# EAGLE design TRV_MRF49_U_V1.1_F (EAGLE 6.3)
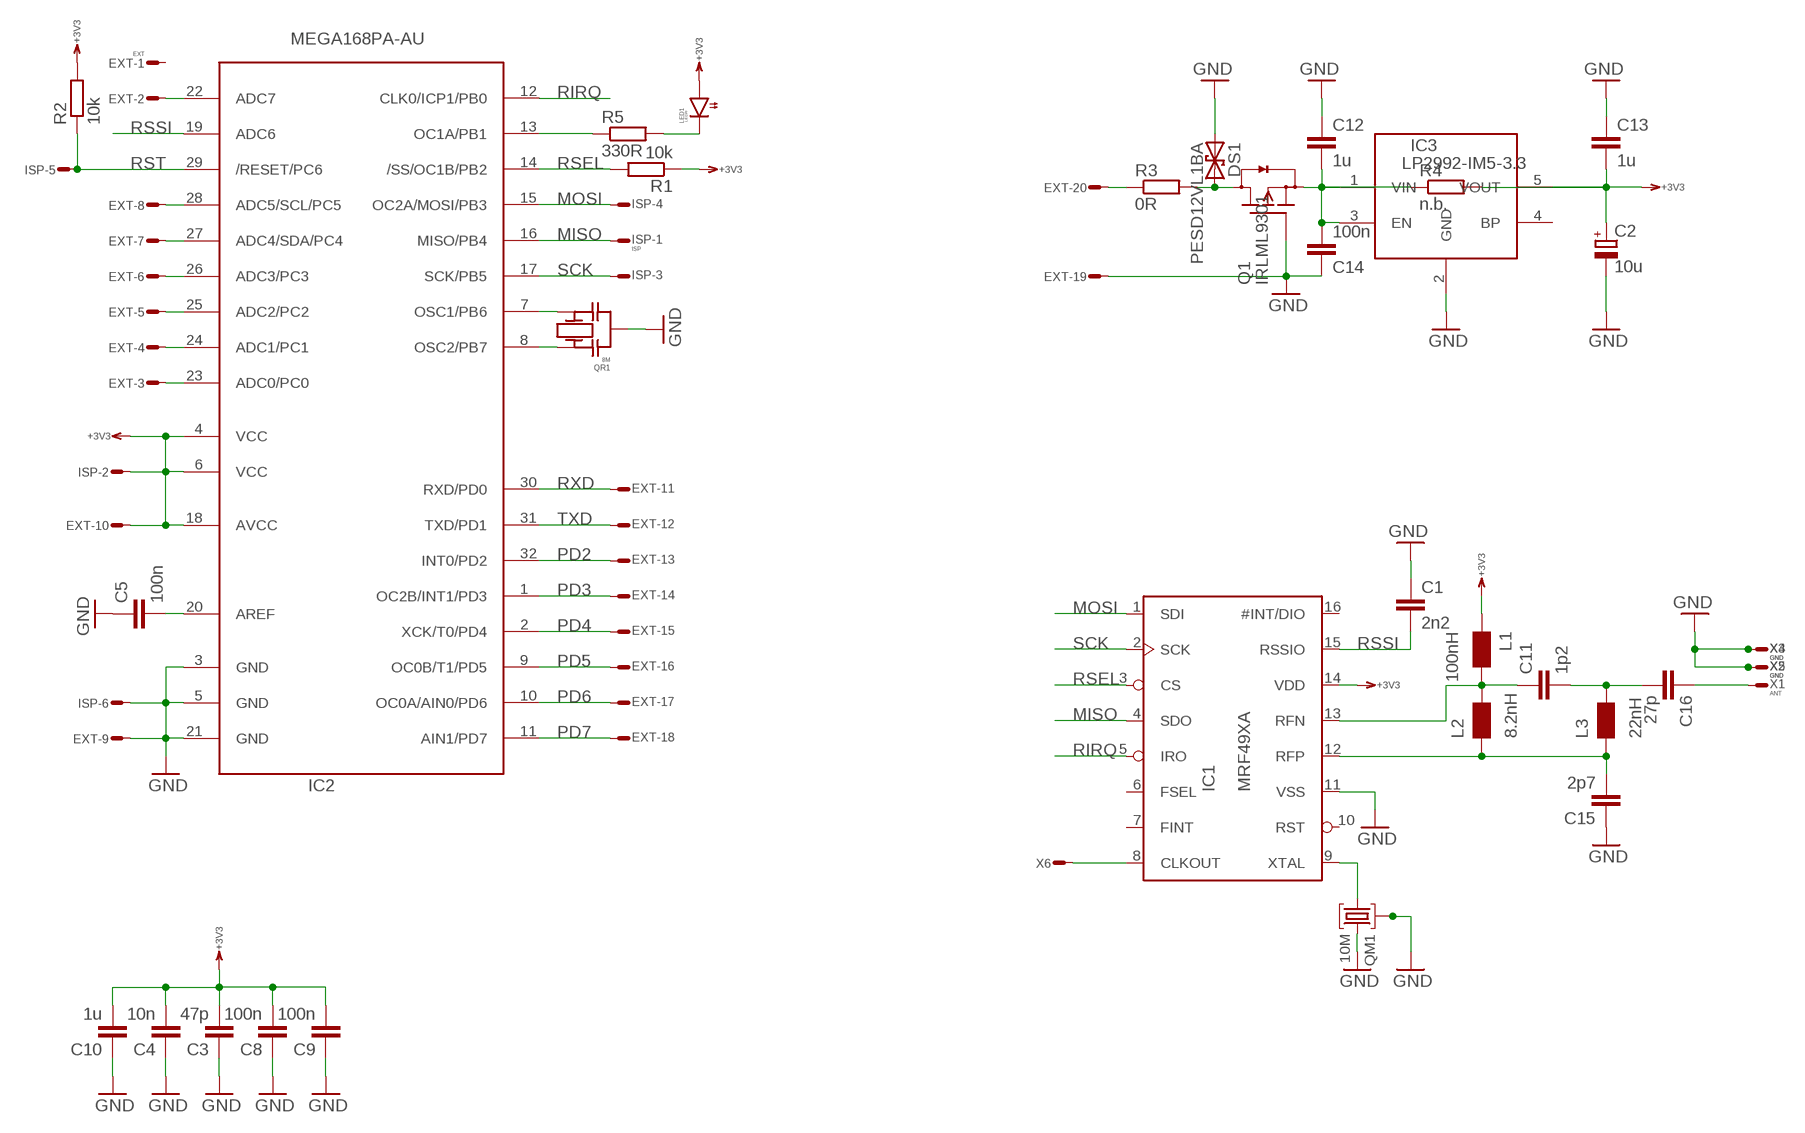
[diagram p0: schematic, sheet 1]

## Parts
C1  2n2  C0603  [0603]
C2  10u  C_POLSMCB  [SMC_B]
C3  47p  C0603  [0603]
C4  10n  C0603  [0603]
C5  100n  C0603  [0603]
C8  100n  C0603  [0603]
C9  100n  C0603  [0603]
C10  1u  C0603  [0603]
C11  1p2  C0603  [0603]
C12  1u  C0603  [0603]
C13  1u  C0603  [0603]
C14  100n  C0603  [0603]
C15  2p7  C0603  [0603]
C16  27p  C0603  [0603]
DS1  PESD12VL1BA  TVS-U323  [SOD323]
EXT  EXT  ML20SE  [ML20S]
IC1  MRF49XA  [TSSOP16]
IC2  MEGA168PA-AU  MEGA168PA  [TQFP32-08]
IC3  LP2992-IM5-3.3  LDO  [SOT23-5]
ISP  ISP  ML6ES  [ML6S]
L1  100nH  L0603  [0603]
L2  8.2nH  L0603  [0603]
L3  22nH  L0603  [0603]
LED1  LEDR  LED0603  [0603]
Q1  IRLML9301  FET-PDSOT23  [SOT23]
QM1  10M  QM5X3.2  [ABM3C]
QR1  8M  QRCR  [CR]
R1  10k  R0603  [0603]
R2  10k  R0603  [0603]
R3  0R  R0603  [0603]
R4  n.b.  R0603  [0603]
R5  330R  R0603  [0603]
X1  ANT  WIREPADS2.54/1.27  [S2.54/1.27]
X2  GND  WIREPADS2.54/1.27  [S2.54/1.27]
X3  GND  WIREPADS2.54/1.27  [S2.54/1.27]
X4  GND  WIREPADS2.54/1.27  [S2.54/1.27]
X5  GND  WIREPADS2.54/1.27  [S2.54/1.27]
X6  WIREPADR  [S1.27R]

## Nets
+3V3: C2.+ C3.2 C4.2 C8.2 C9.2 C10.2 C13.2 EXT.10 IC1.14(VDD) IC2.4(VCC) IC2.6(VCC) IC2.18(AVCC) IC3.5(VOUT) ISP.2 L1.1 LED1.1(A) R1.1 R2.2 R4.2
GND: C1.1 C2.- C3.1 C4.1 C5.1 C8.1 C9.1 C10.1 C12.1 C13.1 C14.1 C15.1 DS1.A EXT.9 EXT.19 IC1.11(VSS) IC2.3(GND) IC2.5(GND) IC2.21(GND) IC3.2(GND) ISP.6 Q1.1(G) QM1.P$2(M1) QM1.P$3 QM1.P$4(M2) QR1.M X2.1(S) X3.1(S) X4.1(S) X5.1(S)
MISO: IC1.4(SDO) IC2.16(MISO/PB4) ISP.1
MOSI: IC1.1(SDI) IC2.15(OC2A/MOSI/PB3) ISP.4
N$1: IC1.8(CLKOUT) X6.1(S)
N$2: C11.2 C16.2 L3.2
N$3: EXT.2 IC2.22(ADC7)
N$4: IC1.9(XTAL) QM1.P$1
N$5: DS1.C Q1.3(D) R3.2
N$6: C5.2 IC2.20(AREF)
N$7: IC2.8(OSC2/PB7) QR1.1
N$8: IC2.7(OSC1/PB6) QR1.2
N$9: EXT.20 R3.1
N$10: IC2.13(OC1A/PB1) R5.1
N$12: C12.2 C14.2 IC3.1(VIN) IC3.3(EN) Q1.2(S) R4.1
N$15: C11.1 IC1.13(RFN) L1.2 L2.2
N$21: LED1.2(C) R5.2
N$24: C15.2 IC1.12(RFP) L2.1 L3.1
N$25: C16.1 X1.1(S)
PC0: EXT.3 IC2.23(ADC0/PC0)
PC1: EXT.4 IC2.24(ADC1/PC1)
PC2: EXT.5 IC2.25(ADC2/PC2)
PC3: EXT.6 IC2.26(ADC3/PC3)
PC4: EXT.7 IC2.27(ADC4/SDA/PC4)
PC5: EXT.8 IC2.28(ADC5/SCL/PC5)
PD2: EXT.13 IC2.32(INT0/PD2)
PD3: EXT.14 IC2.1(OC2B/INT1/PD3)
PD4: EXT.15 IC2.2(XCK/T0/PD4)
PD5: EXT.16 IC2.9(OC0B/T1/PD5)
PD6: EXT.17 IC2.10(OC0A/AIN0/PD6)
PD7: EXT.18 IC2.11(AIN1/PD7)
RIRQ: IC1.5(IRO) IC2.12(CLK0/ICP1/PB0)
RSEL: IC1.3(CS) IC2.14(/SS/OC1B/PB2) R1.2
RSSI: C1.2 IC1.15(RSSIO) IC2.19(ADC6)
RST: IC2.29(/RESET/PC6) ISP.5 R2.1
RXD: EXT.11 IC2.30(RXD/PD0)
SCK: IC1.2(SCK) IC2.17(SCK/PB5) ISP.3
TXD: EXT.12 IC2.31(TXD/PD1)
Unconnected: EXT.1 IC1.6(FSEL) IC1.7(FINT) IC1.10(RST) IC1.16(#INT/DIO) IC3.4(BP)

## Library data of the parts
C1 C3-C5 C8-C16 = RCL:C: Capacitor SMD
C2 = RCL:C_POL: POLARIZED CAPACITOR, European symbol
DS1 = Diode:TVS-U: DIODE
EXT = Conn:ML20?E: HARTING
IC1 = Other:MRF49XA
IC2 = atmel:MEGA168P: MCU, 4/8/16k, TQFP32
IC3 = DCDC:LDO
ISP = Conn:ML6E: HARTING
L1-L3 = RCL:L
LED1 = Optic:LED
Q1 = Transistor:FET-PD
QM1 = QUARTZ:QM
QR1 = QUARTZ:QR
R1-R5 = RCL:R: Resistor SMD
X1-X6 = Conn:WIREPAD: Wire PAD connect wire on PCB

## Board
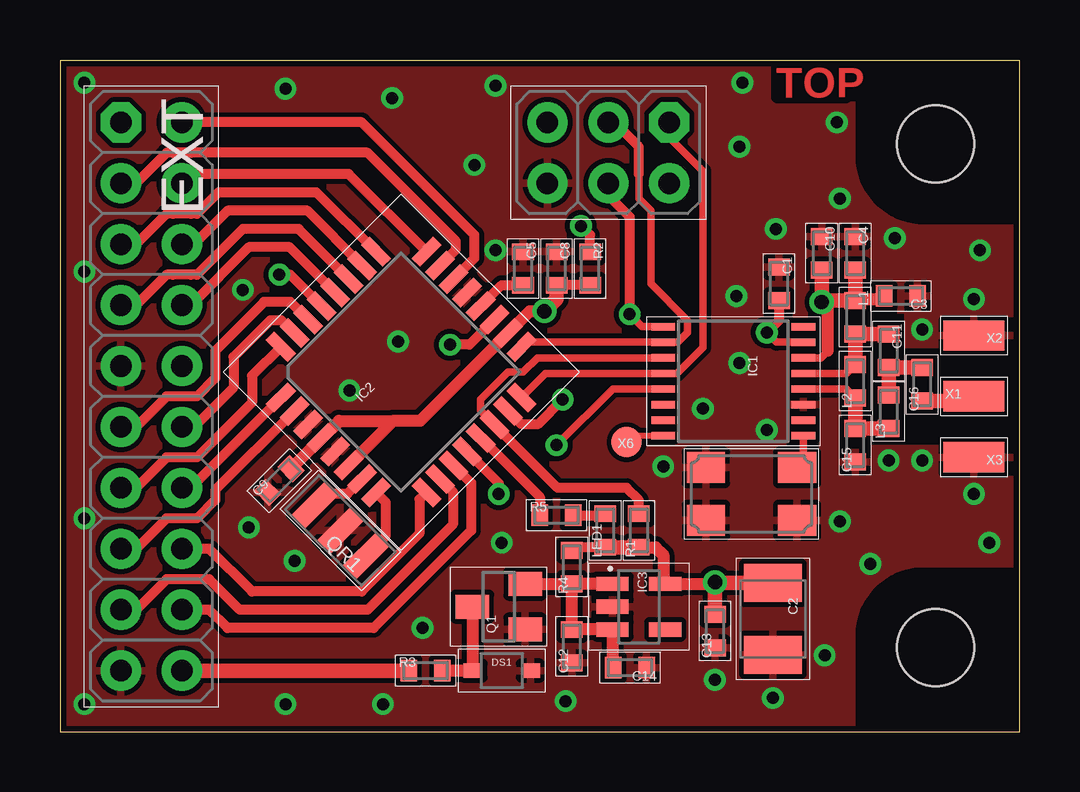
[diagram p1: board, top side]
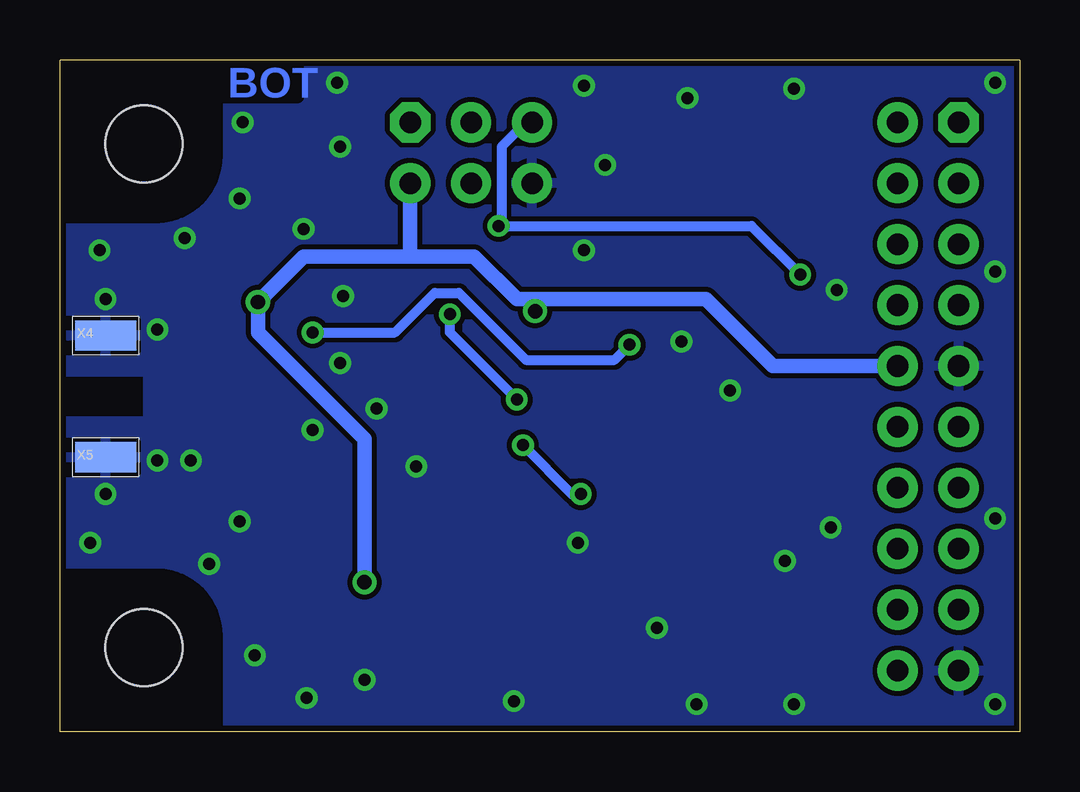
[diagram p2: board, bottom side, seen from below]

Size 40 x 28 mm. Coordinates in mm from the lower left corner, seen from the top.
Outline: 0,0 40,0 40,28 0,28 0,0
Copper layers (1*16): Top 0.035mm / dielectric 1.5mm / Bottom 0.035mm
Design rules "default *": minimum track width 8mil, minimum drill 0.3mm, track to track 8mil, track to pad 8mil, pad to pad 8mil, via to via 8mil, smd to smd 8mil, copper to edge 10mil, drill to drill 8mil, minimum pad ring 5mil, minimum via ring 8mil, stop-mask expansion 4mil, vias tented up to drill 25mil, thermal gap 8mil
Holes 3.2 mm at 36.5,24.5 36.5,3.5
tRestrict: area 32.5,17.1 to 35.2,17.4; area 32.5,11.8 to 33.8,12.1

### Footprints (pad centres in the part's own frame; a part is rotated, then mirrored left to right if it is on the bottom)
0603 = smd 0.7 x 0.9: 1 -0.697,0; 2 0.697,0
SMC_B = smd 1.6 x 2.4: + -1.5,0; - 1.5,0
SOD323 = smd 0.8 x 0.6: A 1.2,0; C -1.2,0
ML20S = drill 0.9 pad 1.676 octagon: 1 -11.43,-1.27 | drill 0.9 pad 1.676: 2 -11.43,1.27; 3 -8.89,-1.27; 4 -8.89,1.27; 5 -6.35,-1.27; 6 -6.35,1.27; 7 -3.81,-1.27; 8 -3.81,1.27; 9 -1.27,-1.27; 10 -1.27,1.27; 11 1.27,-1.27; 12 1.27,1.27; 13 3.81,-1.27; 14 3.81,1.27; 15 6.35,-1.27; 16 6.35,1.27; 17 8.89,-1.27; 18 8.89,1.27; 19 11.43,-1.27; 20 11.43,1.27
TSSOP16 = smd 0.305 x 0.991: 1 -2.275,-2.918; 2 -1.625,-2.918; 3 -0.975,-2.918; 4 -0.325,-2.918; 5 0.325,-2.918; 6 0.975,-2.918; 7 1.625,-2.918; 8 2.275,-2.918; 9 2.275,2.918; 10 1.625,2.918; 11 0.975,2.918; 12 0.325,2.918; 13 -0.325,2.918; 14 -0.975,2.918; 15 -1.625,2.918; 16 -2.275,2.918
TQFP32-08 = smd 1.27 x 0.5: 1 -4.293,2.8; 2 -4.293,2; 3 -4.293,1.2; 4 -4.293,0.4; 5 -4.293,-0.4; 6 -4.293,-1.2; 7 -4.293,-2; 8 -4.293,-2.8; 17 4.293,-2.8; 18 4.293,-2; 19 4.293,-1.2; 20 4.293,-0.4; 21 4.293,0.4; 22 4.293,1.2; 23 4.293,2; 24 4.293,2.8 | smd 0.5 x 1.27: 9 -2.8,-4.293; 10 -2,-4.293; 11 -1.2,-4.293; 12 -0.4,-4.293; 13 0.4,-4.293; 14 1.2,-4.293; 15 2,-4.293; 16 2.8,-4.293; 25 2.8,4.293; 26 2,4.293; 27 1.2,4.293; 28 0.4,4.293; 29 -0.4,4.293; 30 -1.2,4.293; 31 -2,4.293; 32 -2.8,4.293
SOT23-5 = smd 0.6 x 1.35: 1 -0.95,-1.101; 2 0,-1.101; 3 0.95,-1.101; 4 0.95,1.101; 5 -0.951,1.101
ML6S = drill 0.9 pad 1.676 octagon: 1 -2.54,-1.27 | drill 0.9 pad 1.676: 2 -2.54,1.27; 3 0,-1.27; 4 0,1.27; 5 2.54,-1.27; 6 2.54,1.27
SOT23 = smd 1 x 1.4: 1 -0.95,-1.1; 2 0.95,-1.1; 3 0,1.1
ABM3C = smd 1.6 x 1.3: P$1 -1.9,-1.1; P$2 1.9,-1.1; P$3 1.9,1.1; P$4 -1.9,1.1
CR = smd 0.8 x 2: 1 -1.5,0; 2 1.5,0; M 0,0
S2.54/1.27 = smd 1.27 x 2.54: 1 0,0
S1.27R = smd 1.27 x 1.27: 1 0,0

### Placement (x,y rotation side)
C1  29.97,18.67 270 top
C2  29.72,4.7 270 top
C3  35.05,18.16 180 top
C4  33.15,19.94 270 top
C5  19.3,19.3 270 top
C8  20.7,19.3 270 top
C9  9.14,10.46 45 top
C10  31.75,19.94 270 top
C11  34.54,15.88 270 top
C12  21.34,3.56 90 top
C13  27.3,4.19 90 top
C14  23.76,2.67 180 top
C15  33.15,11.94 90 top
C16  35.94,14.48 90 top
DS1  18.41,2.54 0 top
EXT  3.81,13.97 270 top
IC1  28.07,14.61 270 top
IC2  14.22,14.99 45 top
IC3  24.13,5.21 270 top
ISP  22.86,24.13 180 top
L1  33.15,17.27 270 top
L2  33.15,14.61 90 top
L3  34.54,13.34 90 top
LED1  22.73,8.38 90 top
Q1  18.29,5.21 90 top
QM1  28.83,9.91 180 top
QR1  11.68,8.38 135 top
R1  24.13,8.38 90 top
R2  22.1,19.3 270 top
R3  15.24,2.54 0 top
R4  21.34,6.86 90 top
R5  20.7,9.02 0 top
X1  38.1,13.97 270 top
X2  38.1,16.51 90 top
X3  38.1,11.43 90 top
X4  38.1,16.51 270 bottom
X5  38.1,11.43 270 bottom
X6  23.62,12.06 0 top

### Tracks (layer width: path | path; a pad name or v marks a point on that pad's centre or on a via)
+3V3  (via drill 0.6)
  Top 0.305: IC1.14 31.71,15.58 32,15.88
  Top 0.406: C9.2 | 32,17.65 v31.75,17.91 | LED1.1 21.46,7.68 R4.2 | R2.2 C8.2
  Top 0.508: C9.2 IC2.4 11.63,12.95 13.89,12.95 | 32,15.88 32,17.65 | 33.15,18.03 34.35,18.03 C3.2 | R1.1 24.83,7.68 25.15,7.37 25.15,6.24 IC3.5 27.24,6.16 v27.3,6.22 | v20.19,17.53 19.59,17.53 IC2.18 15.02,12.95 13.89,12.95 | IC2.6 13.89,12.95
  Top 0.61: LED1.1 R1.1 | C10.2 v31.75,17.91 31.81,17.97 L1.1 33.15,18.03 C4.2 | C13.2 v27.3,6.22 27.33,6.2 C2.+ | C8.2 20.7,18.03 v20.19,17.53
  Bottom 0.61: v27.3,6.22 27.3,12.19 31.75,16.64 v31.75,17.91 29.84,19.81 25.4,19.81 | EXT.10 10.29,15.24 13.08,18.03 20.19,18.03 | ISP.2 25.4,19.81 | 20.19,18.03 20.95,18.03 22.73,19.81 25.4,19.81 | v20.19,17.53 20.19,18.03
GND  (via drill 0.5)
  other vias: 38.1,18.03 38.1,9.91 34.54,11.3 35.94,11.3 35.94,16.76 34.8,20.57 29.84,20.95 25.15,11.05 21.08,1.27 17.27,23.62 29.72,1.4 38.73,7.87 33.78,6.99 38.35,20.07 32.51,22.23 28.45,27.05 27.3,2.16 15.11,4.32 9.78,7.11 13.84,26.42 13.46,1.14 32.51,8.76 31.88,3.17 9.4,26.8 9.4,1.14 28.32,24.38 18.41,7.87 26.8,13.46 28.32,15.37 12.06,14.22 14.1,16.26 7.87,8.51 29.46,12.57 28.19,18.16 7.62,18.41 18.16,20.07 32.38,25.4 18.16,26.92 1.02,27.05 1.02,1.14 1.02,19.18 1.02,8.89
  pour Top: 0,0 33,0 33,4 arc-90 36,7 40,7 40,11.81 32.64,11.81 32.64,16.13 40,16.13 40,21 36,21 arc-90 33,24 33,28 0,28
  pour Bottom: 0,0 33,0 33,4 arc-90 36,7 40,7 40,12.95 36.32,12.95 36.32,14.99 40,14.99 40,21 36,21 arc-90 33,24 33,28 0,28
MISO
  Top 0.305: IC2.16 20.24,14.93 IC1.4 25.73,14.93 26.8,16 26.8,23.37 25.4,24.77 ISP.1
MOSI  (via drill 0.5)
  Top 0.305: v23.75,17.4 24.27,16.88 IC1.1
  Top 0.406: IC2.15 19.21,12.83 19.94,12.83 v20.95,13.84 | ISP.4 22.86,22.35 23.75,21.46 v23.75,17.4
  Bottom 0.406: v20.95,13.84 23.75,16.64 v23.75,17.4
N$1
  Top 0.254: IC1.8 23.89,12.33 X6.1
N$2
  Top 0.61: L3.2 C11.2 C16.2
N$3
  Top 0.406: IC2.22 17.27,19.73 17.27,20.7 12.57,25.4 EXT.2
N$4
  Top 0.254: IC1.9 30.98,12.2 30.99,12.19
  Top 0.305: 30.99,12.19 30.99,11.27 QM1.P$1
N$5
  Top 0.508: R3.2 DS1.C 17.21,5.18
  Top 0.61: 17.21,5.18 Q1.3
N$6
  Top 0.406: IC2.20 18.41,18.61 C5.2
N$7
  Top 0.406: IC2.8 13.59,9.55 13.59,8.17 QR1.1
N$8
  Top 0.406: IC2.7 11.97,9.91 11.18,9.91 10.71,9.44 QR1.2
N$9
  Top 0.61: EXT.20 R3.1
N$10
  Top 0.406: IC2.13 20,9.77 R5.1
N$12
  Top 0.406: IC3.1 23.43,6.16
  Top 0.508: C14.2 23.06,4.23 IC3.3 C12.2 R4.1 | IC3.1 R4.1 | Q1.2 R4.1
N$15
  Top 0.305: IC1.13 32.77,14.93 L2.2
  Top 0.61: L2.2 L1.2 C11.1
N$21
  Top 0.406: R5.2 22.67,9.02 LED1.2
N$24
  Top 0.305: IC1.12 32.77,14.28 L2.1
  Top 0.61: L2.1 C15.2 L3.1
N$25
  Top 0.61: C16.1 37.91,13.78 X1.1
PC0
  Top 0.406: IC2.23 16.51,20.1 16.51,20.45 12.83,24.13 5.46,24.13 4.7,24.13 4.45,24.13 3.17,22.86 EXT.3
PC1
  Top 0.406: IC2.24 12.04,23.24 5.46,23.24 EXT.4
PC2
  Top 0.406: IC2.25 10.69,22.48 6.6,22.48 5.71,21.59 5.46,21.59 4.7,21.59 4.45,21.59 3.17,20.32 EXT.5
PC3
  Top 0.406: IC2.26 10.32,21.72 6.99,21.72 5.59,20.32 EXT.6
PC4
  Top 0.406: IC2.27 9.95,20.95 7.62,20.95 5.71,19.05 5.46,19.05 4.7,19.05 4.45,19.05 3.17,17.78 EXT.7
PC5
  Top 0.406: IC2.28 9.58,20.19 7.87,20.19 5.46,17.78 EXT.8
PD2
  Top 0.406: IC2.32 8,14.83 8,13.72 5.71,11.43 5.46,11.43 4.7,11.43 4.45,11.43 3.17,10.16 EXT.13
PD3
  Top 0.406: IC2.1 5.44,10.16 EXT.14
PD4
  Top 0.406: IC2.2 6.48,10.07 6.48,9.65 5.71,8.89 5.46,8.89 4.7,8.89 4.45,8.89 3.17,7.62 EXT.15
PD5
  Top 0.406: IC2.9 14.99,9.68 14.99,8.26 12.57,5.84 8,5.84 6.22,7.62 EXT.16
PD6
  Top 0.406: IC2.10 16.38,10 16.38,8.64 12.83,5.08 7.49,5.08 6.22,6.35 5.46,6.35 4.7,6.35 4.45,6.35 3.17,5.08 EXT.17
PD7
  Top 0.406: IC2.11 17.14,10.37 17.14,8.38 13.08,4.32 6.99,4.32 6.22,5.08 EXT.18
RIRQ  (via drill 0.5)
  Top 0.305: IC1.5 23.04,14.28 v20.7,11.94
  Top 0.406: IC2.12 18.29,10.36 v18.29,9.91
  Bottom 0.406: v20.7,11.94 18.67,9.91 v18.29,9.91
RSEL
  Top 0.305: IC1.3 19.9,15.58 19.3,14.99 18.67,14.99 17.53,13.84 17.53,13.38 18.06,12.85 IC2.14
  Top 0.406: R1.2 24.13,9.65 23.62,10.16 20.75,10.16 18.06,12.85
RSSI  (via drill 0.5)
  Top 0.305: IC1.15 29.87,16.23 v29.46,16.64
  Top 0.406: IC2.19 17.06,16.13 v16.26,16.13 | C1.2 29.97,17.14 v29.46,16.64
  Bottom 0.406: v16.26,16.13 16.89,15.49 20.57,15.49 23.37,18.29 24.38,18.29 26.04,16.64 v29.46,16.64
RST  (via drill 0.5)
  Top 0.406: IC2.29 9.59,19.05 v9.14,19.05 | R2.1 22.1,20.7 v21.72,21.08
  Bottom 0.406: ISP.5 20.57,25.4 21.59,24.38 21.59,21.21 v21.72,21.08 11.18,21.08 v9.14,19.05
RXD
  Top 0.406: IC2.30 9.61,17.91 8.51,17.91 6.48,15.88 6.48,14.73 5.71,13.97 5.46,13.97 4.7,13.97 4.45,13.97 3.17,12.7 EXT.11
SCK
  Top 0.305: IC2.17 19.43,16.23 IC1.2 25.75,16.23 26.16,16.64 26.16,17.14 24.64,18.67 24.64,21.72 24.13,22.23 24.13,23.24
  Top 0.406: ISP.3 23.11,25.4 24.13,24.38 24.13,23.24
TXD
  Top 0.406: IC2.31 9.24,17.14 8.76,17.14 7.24,15.62 7.24,14.35 5.59,12.7 EXT.12

### Text on the board
Top: TOP
Bottom: BOT